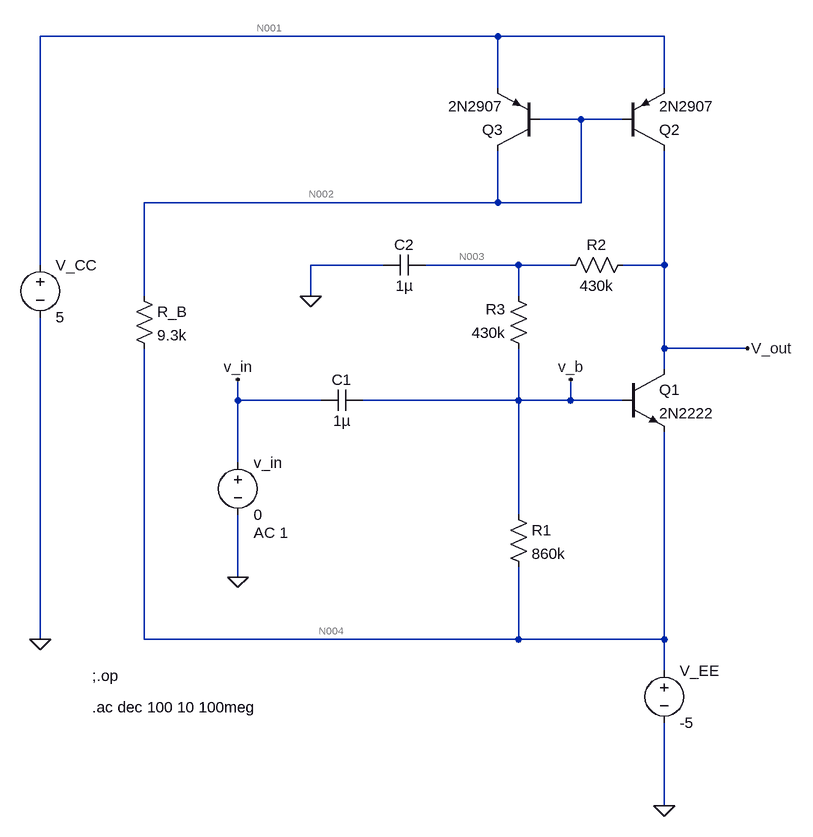
[diagram p0: schematic active_load_amplification_stage.asc]
active_load_amplification_stage.asc, the LTspice schematic file:
Version 4
SHEET 1 880 680
WIRE 240 -576 -464 -576
WIRE 496 -576 240 -576
WIRE 240 -496 240 -576
WIRE 496 -496 496 -576
WIRE 368 -448 304 -448
WIRE 432 -448 368 -448
WIRE 240 -320 240 -400
WIRE 240 -320 -304 -320
WIRE 368 -320 368 -448
WIRE 368 -320 240 -320
WIRE -464 -224 -464 -576
WIRE 64 -224 -48 -224
WIRE 272 -224 128 -224
WIRE 352 -224 272 -224
WIRE 496 -224 496 -400
WIRE 496 -224 432 -224
WIRE -304 -176 -304 -320
WIRE -48 -176 -48 -224
WIRE 272 -176 272 -224
WIRE 496 -96 496 -224
WIRE 624 -96 496 -96
WIRE 496 -64 496 -96
WIRE -160 -16 -160 -48
WIRE -32 -16 -160 -16
WIRE 272 -16 272 -96
WIRE 272 -16 32 -16
WIRE 352 -16 352 -48
WIRE 352 -16 272 -16
WIRE 432 -16 352 -16
WIRE -160 80 -160 -16
WIRE 272 160 272 -16
WIRE -160 256 -160 160
WIRE -464 352 -464 -144
WIRE -304 352 -304 -96
WIRE 272 352 272 240
WIRE 272 352 -304 352
WIRE 496 352 496 32
WIRE 496 352 272 352
WIRE 496 400 496 352
WIRE 496 608 496 480
FLAG 496 608 0
FLAG 624 -96 V_out
FLAG -160 -48 v_in
FLAG 352 -48 v_b
FLAG -160 256 0
FLAG -48 -176 0
FLAG -464 352 0
SYMBOL voltage -464 -240 R0
WINDOW 123 0 0 Left 0
WINDOW 39 0 0 Left 0
SYMATTR InstName V_CC
SYMATTR Value 5
SYMBOL cap 32 -32 R90
WINDOW 0 0 32 VBottom 2
WINDOW 3 32 32 VTop 2
SYMATTR InstName C1
SYMATTR Value 1µ
SYMBOL npn 432 -64 R0
SYMATTR InstName Q1
SYMATTR Value 2N2222
SYMBOL voltage -160 64 R0
WINDOW 123 24 124 Left 2
WINDOW 39 0 0 Left 0
SYMATTR InstName v_in
SYMATTR Value 0
SYMATTR Value2 AC 1
SYMBOL voltage 496 384 R0
SYMATTR InstName V_EE
SYMATTR Value -5
SYMBOL pnp 432 -400 M180
SYMATTR InstName Q2
SYMATTR Value 2N2907
SYMBOL pnp 304 -400 R180
SYMATTR InstName Q3
SYMATTR Value 2N2907
SYMBOL res -320 -192 R0
SYMATTR InstName R_B
SYMATTR Value 9.3k
SYMBOL res 448 -240 R90
WINDOW 0 0 56 VBottom 2
WINDOW 3 32 56 VTop 2
SYMATTR InstName R2
SYMATTR Value 430k
SYMBOL res 288 -80 R180
WINDOW 0 36 76 Left 2
WINDOW 3 36 40 Left 2
SYMATTR InstName R3
SYMATTR Value 430k
SYMBOL cap 128 -240 R90
WINDOW 0 0 32 VBottom 2
WINDOW 3 32 32 VTop 2
SYMATTR InstName C2
SYMATTR Value 1µ
SYMBOL res 256 144 R0
SYMATTR InstName R1
SYMATTR Value 860k
TEXT -384 408 Left 2 !;.op
TEXT -384 456 Left 2 !.ac dec 100 10 100meg

The netlist it stands for:
* active_load_amplification_stage.asc
V_CC N001 0 5
C1 v_b v_in 1µ
Q1 V_out v_b N004 0 2N2222
v_in v_in 0 0 AC 1
V_EE N004 0 -5
Q2 V_out N002 N001 0 2N2907
Q3 N002 N002 N001 0 2N2907
R_B N002 N004 9.3k
R2 V_out N003 430k
R3 v_b N003 430k
C2 N003 0 1µ
R1 v_b N004 860k
.model NPN NPN
.model PNP PNP
.lib standard.bjt
;.op
.ac dec 100 10 100meg
.backanno
.end

* Results of the author's LTspice run, read from the files saved beside the schematic
* Operating Point, zero values left out:
*   V(n001) = 5 V
*   V(v_b) = -4.345 V
*   V(v_out) = 516.9 mV
*   V(n004) = -5 V
*   V(n002) = 4.345 V
*   V(n003) = -1.914 V
*   Ic(Q3) = -996.8 µA
*   Ib(Q3) = -4 µA
*   Ie(Q3) = 1.001 mA
*   Ic(Q2) = -1.028 mA
*   Ib(Q2) = -3.999 µA
*   Ie(Q2) = 1.032 mA
*   Ic(Q1) = 1.023 mA
*   Ib(Q1) = 4.892 µA
*   Ie(Q1) = -1.028 mA
*   I(R1) = 761.4 nA
*   I(R3) = -5.654 µA
*   I(R2) = 5.654 µA
*   I(R_b) = 1.005 mA
*   I(V_ee) = 2.033 mA
*   I(V_cc) = -2.033 mA
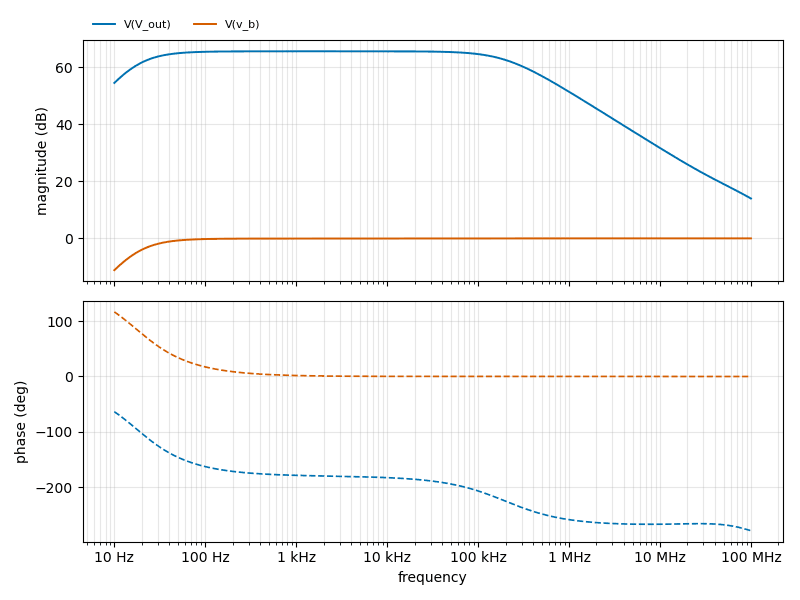
[diagram p1: AC Analysis of active_load_amplification_stage.asc, plotted from the saved traces]
* AC Analysis, 1 run:
*   V(V_out): 54.54 dB at 10 Hz, 13.97 dB at 100 MHz, peak 65.63 dB at 1.995 kHz, 3 dB below the peak at 23.21 Hz and 198.5 kHz
*   V(v_b): -11.16 dB at 10 Hz, -0.00 dB at 100 MHz, peak -0.00 dB at 100 MHz, 3 dB below the peak at 23.5 Hz